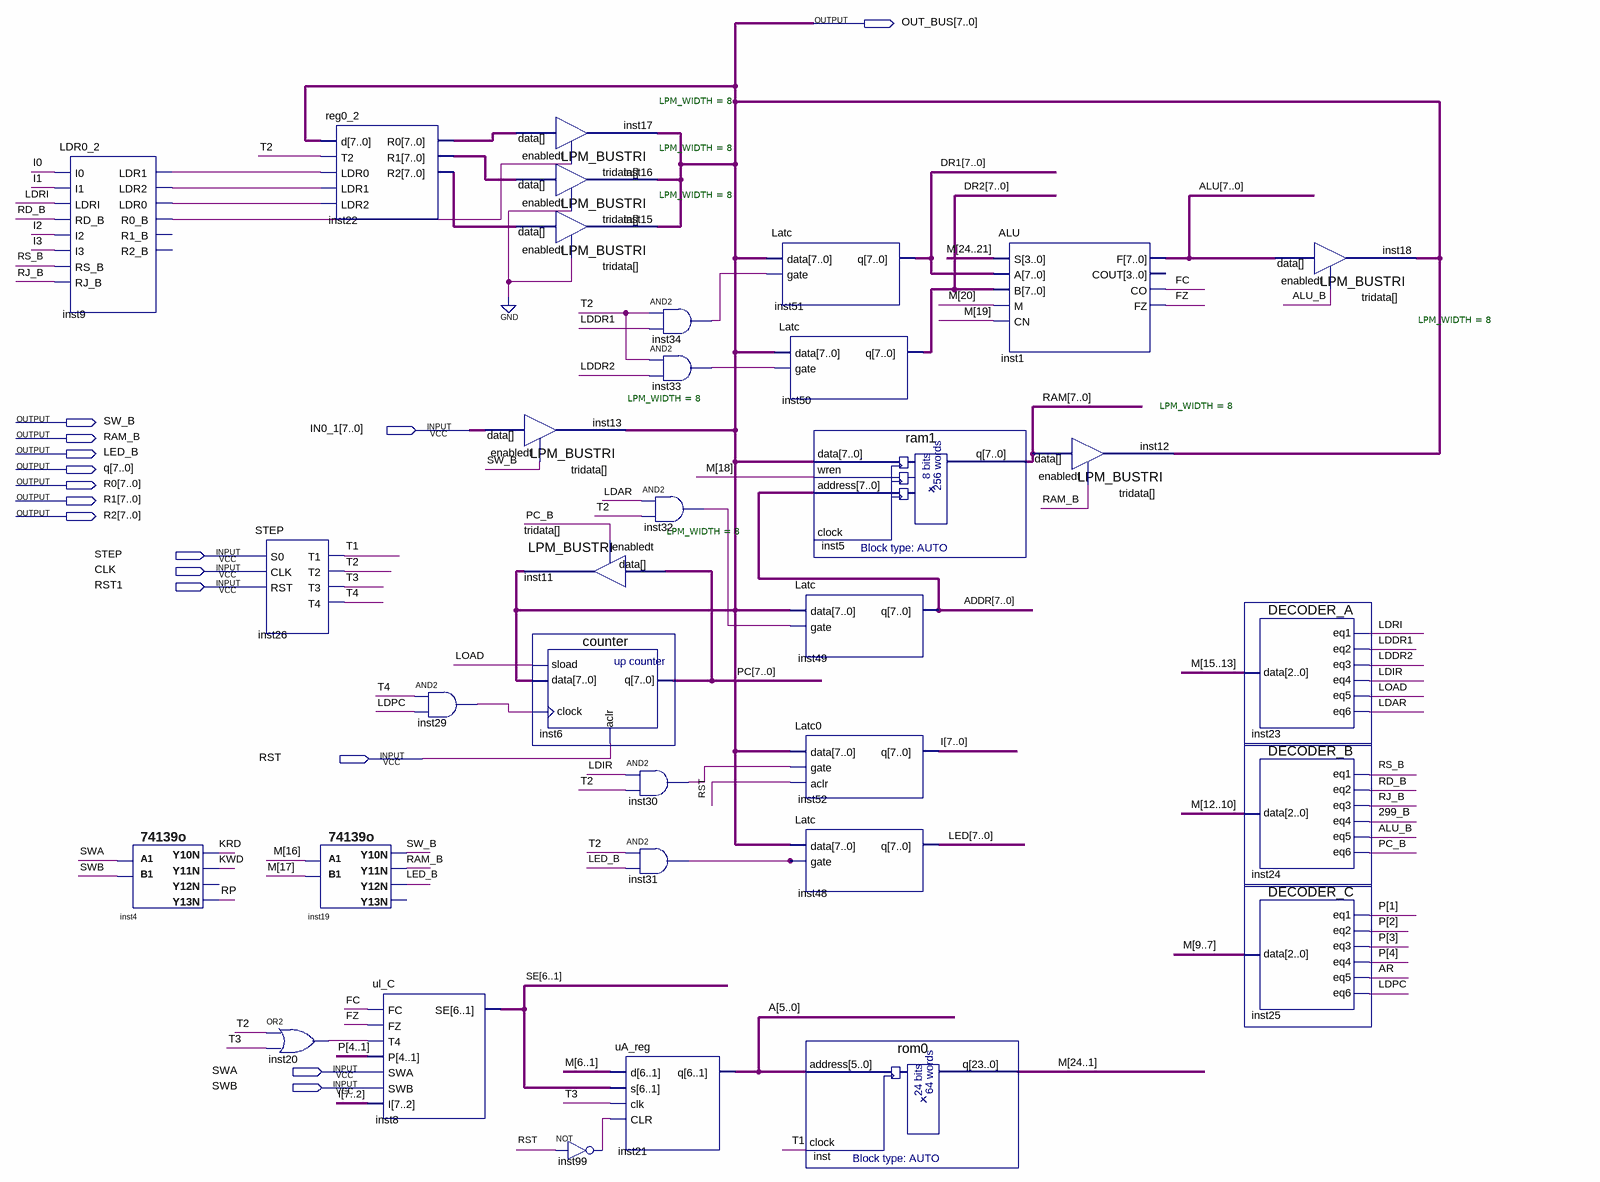
[diagram p0: schematic sheet]
// Quartus schematic CPU.bdf as structural Verilog: 34 symbols, 15 pins
module CPU (
  input  [7:0] IN0_1,
  input  STEP,
  input  CLK,
  input  RST1,
  input  RST,
  input  SWA,
  input  SWB,
  output [7:0] OUT_BUS,
  output SW_B,
  output RAM_B,
  output LED_B,
  output [7:0] q,
  output [7:0] R0,
  output [7:0] R1,
  output [7:0] R2
);

  wire \299_B , ALU_B, AR, FC, FZ, inst9_ldr0, inst9_ldr1, inst9_ldr2, inst9_r0_b, inst20_out, inst29_out,
       inst30_out, inst31_out, inst32_out, inst33_out, inst34_out, inst99_out, KRD, KWD, LDAR, LDDR1, LDDR2,
       LDIR, LDPC, LDRI, LOAD, PC_B, RD_B, RJ_B, RP, RS_B, T1, T2, T3, T4;
  wire [4:1] P;
  wire [5:0] A;
  wire [6:1] SE;
  wire [7:0] ADDR, ALU, DR1, DR2, I, inst22_r0, inst22_r1, inst22_r2, LED, PC, RAM;
  wire [24:1] M;

  LDR0_2 inst9 (
    .I0(I[0]), .I1(I[1]), .LDRI(LDRI), .RD_B(RD_B), .I2(I[2]), .I3(I[3]), .RS_B(RS_B), .RJ_B(RJ_B),
    .LDR1(inst9_ldr1), .LDR2(inst9_ldr2), .LDR0(inst9_ldr0), .R0_B(inst9_r0_b));  // open: R1_B, R2_B
  \74139o  inst4 (.A1(SWA), .B1(SWB), .Y10N(KRD), .Y11N(KWD), .Y13N(RP));  // open: Y12N
  STEP inst26 (.T1(T1), .T2(T2), .T3(T3), .T4(T4));  // open: S0, CLK, RST
  or inst20 (inst20_out, T2, T3);
  reg0_2 inst22 (
    .d(OUT_BUS), .LDR0(inst9_ldr1), .LDR1(inst9_ldr2), .LDR2(inst9_ldr0), .T2(T2), .R0(inst22_r0),
    .R1(inst22_r1), .R2(inst22_r2));
  \74139o  inst19 (.A1(M[16]), .B1(M[17]), .Y10N(SW_B), .Y11N(RAM_B), .Y12N(LED_B));  // open: Y13N
  and inst29 (inst29_out, T4, LDPC);
  ul_C inst8 (.FC(FC), .FZ(FZ), .T4(inst20_out), .P(P), .I(I[7:2]), .SE(SE));  // open: SWA, SWB
  LPM_BUSTRI #(.LPM_WIDTH(8)) inst13 (.data(IN0_1), .enabledt(SW_B), .tridata(OUT_BUS));
  LPM_BUSTRI #(.LPM_WIDTH(8)) inst17 (.data(inst22_r0), .enabledt(inst9_r0_b), .tridata(OUT_BUS));
  LPM_BUSTRI #(.LPM_WIDTH(8)) inst16 (.data(inst22_r1), .enabledt(1'b0), .tridata(OUT_BUS));
  LPM_BUSTRI #(.LPM_WIDTH(8)) inst15 (.data(inst22_r2), .enabledt(1'b0), .tridata(OUT_BUS));
  LPM_BUSTRI #(.LPM_WIDTH(8)) inst11 (.data(PC), .enabledt(PC_B), .tridata(OUT_BUS));
  counter inst6 (.sload(LOAD), .data(OUT_BUS), .clock(inst29_out), .aclr(RST), .q(PC));
  uA_reg inst21 (.d(M[6:1]), .s(SE), .clk(T3), .CLR(inst99_out), .q(A));
  not inst99 (inst99_out, RST);
  and inst34 (inst34_out, T2, LDDR1);
  and inst33 (inst33_out, T2, LDDR2);
  and inst32 (inst32_out, LDAR, T2);
  and inst30 (inst30_out, LDIR, T2);
  and inst31 (inst31_out, T2, LED_B);
  Latc inst51 (.data(OUT_BUS), .gate(inst34_out), .q(DR1));
  Latc inst50 (.data(OUT_BUS), .gate(inst33_out), .q(DR2));
  Latc inst49 (.data(OUT_BUS), .gate(inst32_out), .q(ADDR));
  Latc0 inst52 (.data(OUT_BUS), .gate(inst30_out), .aclr(RST), .q(I));
  Latc inst48 (.data(OUT_BUS), .gate(inst31_out), .q(LED));
  ram1 inst5 (.data(OUT_BUS), .wren(M[18]), .address(ADDR), .q(RAM));  // open: clock
  rom0 inst (.address(A), .clock(T1), .q(M));
  ALU inst1 (.S(M[24:21]), .A(DR1), .B(DR2), .M(M[20]), .CN(M[19]), .F(ALU), .CO(FC), .FZ(FZ));  // open: COUT
  LPM_BUSTRI #(.LPM_WIDTH(8)) inst12 (.data(RAM), .enabledt(RAM_B), .tridata(OUT_BUS));
  LPM_BUSTRI #(.LPM_WIDTH(8)) inst18 (.data(ALU), .enabledt(ALU_B), .tridata(OUT_BUS));
  DECODER_A inst23 (.data(M[15:13]), .eq1(LDRI), .eq2(LDDR1), .eq3(LDDR2), .eq4(LDIR), .eq5(LOAD), .eq6(LDAR));
  DECODER_B inst24 (.data(M[12:10]), .eq1(RS_B), .eq2(RD_B), .eq3(RJ_B), .eq4(\299_B ), .eq5(ALU_B), .eq6(PC_B));
  DECODER_C inst25 (.data(M[9:7]), .eq1(P[1]), .eq2(P[2]), .eq3(P[3]), .eq4(P[4]), .eq5(AR), .eq6(LDPC));
endmodule
